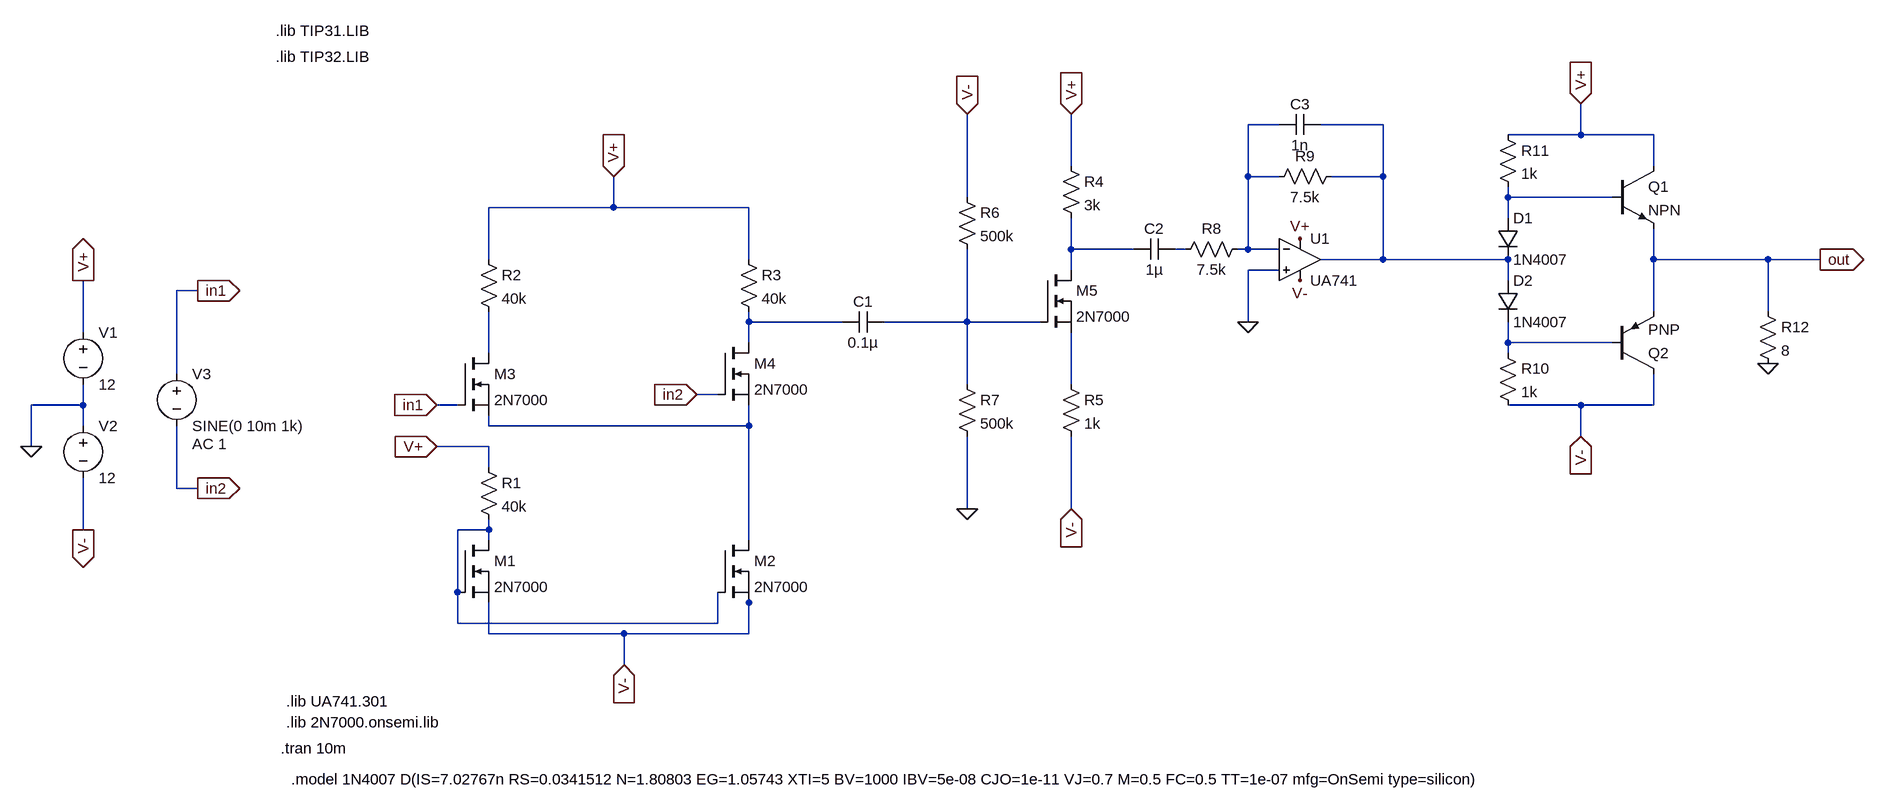
[diagram p0: schematic EW2_project1_final_1.asc]
EW2_project1_final_1.asc, the LTspice schematic file:
Version 4
SHEET 1 2576 680
WIRE 1280 -384 1232 -384
WIRE 1440 -384 1344 -384
WIRE 1744 -368 1744 -416
WIRE 1744 -368 1632 -368
WIRE 1856 -368 1744 -368
WIRE 960 -320 960 -400
WIRE 1856 -320 1856 -368
WIRE 1232 -304 1232 -384
WIRE 1280 -304 1232 -304
WIRE 1440 -304 1440 -384
WIRE 1440 -304 1360 -304
WIRE 800 -272 800 -400
WIRE 1632 -272 1632 -288
WIRE 1792 -272 1632 -272
WIRE 256 -256 256 -304
WIRE 256 -256 64 -256
WIRE 464 -256 256 -256
WIRE 1632 -240 1632 -272
WIRE 960 -192 960 -240
WIRE 1056 -192 960 -192
WIRE 1136 -192 1120 -192
WIRE 1232 -192 1232 -304
WIRE 1232 -192 1216 -192
WIRE 1280 -192 1232 -192
WIRE 64 -176 64 -256
WIRE 464 -176 464 -256
WIRE 1440 -176 1440 -304
WIRE 1440 -176 1344 -176
WIRE 1632 -176 1440 -176
WIRE 1856 -176 1856 -224
WIRE 2032 -176 1856 -176
WIRE 2112 -176 2032 -176
WIRE 960 -160 960 -192
WIRE 1280 -160 1232 -160
WIRE 1632 -144 1632 -176
WIRE -384 -128 -416 -128
WIRE 1856 -96 1856 -176
WIRE 2032 -96 2032 -176
WIRE 464 -80 464 -96
WIRE 608 -80 464 -80
WIRE 800 -80 800 -192
WIRE 800 -80 672 -80
WIRE 912 -80 800 -80
WIRE 1232 -80 1232 -160
WIRE -560 -64 -560 -144
WIRE 464 -48 464 -80
WIRE 1632 -48 1632 -80
WIRE 1792 -48 1632 -48
WIRE 64 -32 64 -96
WIRE 1632 -32 1632 -48
WIRE -416 0 -416 -128
WIRE 800 16 800 -80
WIRE 960 16 960 -64
WIRE 416 32 384 32
WIRE -560 48 -560 16
WIRE -560 48 -640 48
WIRE 16 48 -16 48
WIRE 1744 48 1632 48
WIRE 1856 48 1856 0
WIRE 1856 48 1744 48
WIRE -560 80 -560 48
WIRE 64 80 64 64
WIRE 464 80 464 48
WIRE 464 80 64 80
WIRE 1744 96 1744 48
WIRE -640 112 -640 48
WIRE 64 112 -16 112
WIRE 64 144 64 112
WIRE -416 176 -416 80
WIRE -384 176 -416 176
WIRE 800 208 800 96
WIRE 960 208 960 96
WIRE -560 240 -560 160
WIRE 64 240 64 224
WIRE 64 240 16 240
WIRE 64 256 64 240
WIRE 464 256 464 80
WIRE 16 336 16 240
WIRE 464 352 464 336
WIRE 16 384 16 336
WIRE 416 384 416 336
WIRE 416 384 16 384
WIRE 64 400 64 352
WIRE 272 400 64 400
WIRE 464 400 464 352
WIRE 464 400 272 400
WIRE 272 448 272 400
FLAG -640 112 0
FLAG -560 -144 V+
IOPIN -560 -144 Out
FLAG -560 240 V-
IOPIN -560 240 Out
FLAG -16 112 V+
IOPIN -16 112 In
FLAG 272 448 V-
IOPIN 272 448 In
FLAG 256 -304 V+
IOPIN 256 -304 In
FLAG -384 -128 in1
IOPIN -384 -128 Out
FLAG -16 48 in1
IOPIN -16 48 In
FLAG 384 32 in2
IOPIN 384 32 In
FLAG 960 -400 V+
IOPIN 960 -400 In
FLAG 960 208 V-
IOPIN 960 208 In
FLAG 800 208 0
FLAG 800 -400 V-
IOPIN 800 -400 In
FLAG 1232 -80 0
FLAG 1312 -208 V+
FLAG 1312 -144 V-
FLAG -384 176 in2
IOPIN -384 176 Out
FLAG 1744 -416 V+
IOPIN 1744 -416 In
FLAG 1744 96 V-
IOPIN 1744 96 In
FLAG 2032 -16 0
FLAG 2112 -176 out
IOPIN 2112 -176 Out
SYMBOL nmos 16 256 R0
SYMATTR InstName M1
SYMATTR Value 2N7000
SYMATTR Prefix X
SYMBOL nmos 416 256 R0
SYMATTR InstName M2
SYMATTR Value 2N7000
SYMATTR Prefix X
SYMBOL nmos 16 -32 R0
SYMATTR InstName M3
SYMATTR Value 2N7000
SYMATTR Prefix X
SYMBOL nmos 416 -48 R0
SYMATTR InstName M4
SYMATTR Value 2N7000
SYMATTR Prefix X
SYMBOL voltage -560 -80 R0
WINDOW 123 0 0 Left 0
WINDOW 39 0 0 Left 0
SYMATTR InstName V1
SYMATTR Value 12
SYMBOL voltage -560 64 R0
WINDOW 123 0 0 Left 0
WINDOW 39 0 0 Left 0
SYMATTR InstName V2
SYMATTR Value 12
SYMBOL res 48 128 R0
SYMATTR InstName R1
SYMATTR Value 40k
SYMBOL res 48 -192 R0
SYMATTR InstName R2
SYMATTR Value 40k
SYMBOL res 448 -192 R0
SYMATTR InstName R3
SYMATTR Value 40k
SYMBOL cap 672 -96 R90
WINDOW 0 0 32 VBottom 2
WINDOW 3 32 32 VTop 2
SYMATTR InstName C1
SYMATTR Value 0.1µ
SYMBOL nmos 912 -160 R0
SYMATTR InstName M5
SYMATTR Value 2N7000
SYMATTR Prefix X
SYMBOL res 944 -336 R0
SYMATTR InstName R4
SYMATTR Value 3k
SYMBOL res 944 0 R0
SYMATTR InstName R5
SYMATTR Value 1k
SYMBOL res 784 -288 R0
SYMATTR InstName R6
SYMATTR Value 500k
SYMBOL res 784 0 R0
SYMATTR InstName R7
SYMATTR Value 500k
SYMBOL cap 1120 -208 R90
WINDOW 0 0 32 VBottom 2
WINDOW 3 32 32 VTop 2
SYMATTR InstName C2
SYMATTR Value 1µ
SYMBOL OpAmps\\opamp2 1312 -240 R0
SYMATTR InstName U1
SYMATTR Value UA741
SYMBOL res 1232 -208 R90
WINDOW 0 0 56 VBottom 2
WINDOW 3 32 56 VTop 2
SYMATTR InstName R8
SYMATTR Value 7.5k
SYMBOL res 1376 -320 R90
WINDOW 0 0 56 VBottom 2
WINDOW 3 32 56 VTop 2
SYMATTR InstName R9
SYMATTR Value 7.5k
SYMBOL cap 1344 -400 R90
WINDOW 0 0 32 VBottom 2
WINDOW 3 32 32 VTop 2
SYMATTR InstName C3
SYMATTR Value 1n
SYMBOL voltage -416 -16 R0
WINDOW 123 24 124 Left 2
WINDOW 39 0 0 Left 0
SYMATTR Value2 AC 1
SYMATTR InstName V3
SYMATTR Value SINE(0 10m 1k)
SYMBOL diode 1616 -240 R0
SYMATTR InstName D1
SYMATTR Value 1N4007
SYMBOL diode 1616 -144 R0
SYMATTR InstName D2
SYMATTR Value 1N4007
SYMBOL res 1616 -48 R0
SYMATTR InstName R10
SYMATTR Value 1k
SYMBOL res 1616 -384 R0
SYMATTR InstName R11
SYMATTR Value 1k
SYMBOL npn 1792 -320 R0
SYMATTR InstName Q1
SYMATTR Prefix Qtip31
SYMBOL pnp 1792 0 M180
SYMATTR InstName Q2
SYMATTR Prefix Qtip32
SYMBOL res 2016 -112 R0
SYMATTR InstName R12
SYMATTR Value 8
TEXT -248 536 Left 2 !.lib 2N7000.onsemi.lib
TEXT -248 504 Left 2 !.lib UA741.301
TEXT -256 576 Left 2 !.tran 10m
TEXT -240 624 Left 2 !.model 1N4007 D(IS=7.02767n RS=0.0341512 N=1.80803 EG=1.05743 XTI=5 BV=1000 IBV=5e-08 CJO=1e-11 VJ=0.7 M=0.5 FC=0.5 TT=1e-07 mfg=OnSemi type=silicon)
TEXT -264 -528 Left 2 !.lib TIP31.LIB
TEXT -264 -488 Left 2 !.lib TIP32.LIB

The netlist it stands for:
* EW2_project1_final_1.asc
XM1 N012 N012 V- 2N7000  ; pins D G S
XM2 N011 N012 V- 2N7000  ; pins D G S
XM3 N009 in1 N011 2N7000  ; pins D G S
XM4 N006 in2 N011 2N7000  ; pins D G S
V1 V+ 0 12
V2 0 V- 12
R1 V+ N012 40k
R2 V+ N009 40k
R3 V+ N006 40k
C1 N007 N006 0.1µ
XM5 N004 N007 N010 2N7000  ; pins D G S
R4 V+ N004 3k
R5 N010 V- 1k
R6 V- N007 500k
R7 N007 0 500k
C2 N005 N004 1µ
XU1 0 N001 V+ V- N002 UA741  ; pins In+ In- V+ V- OUT
R8 N001 N005 7.5k
R9 N002 N001 7.5k
C3 N002 N001 1n
V3 in1 in2 SINE(0 10m 1k) AC 1
D1 N003 N002 1N4007
D2 N002 N008 1N4007
R10 N008 V- 1k
R11 V+ N003 1k
Q1 V+ N003 out 0 NPN
Q2 V- N008 out 0 PNP
R12 out 0 8
.model D D
.lib standard.dio
.model NPN NPN
.model PNP PNP
.lib standard.bjt
.lib 2N7000.onsemi.lib
.lib UA741.301
.tran 10m
.model 1N4007 D(IS=7.02767n RS=0.0341512 N=1.80803 EG=1.05743 XTI=5 BV=1000 IBV=5e-08 CJO=1e-11 VJ=0.7 M=0.5 FC=0.5 TT=1e-07 mfg=OnSemi type=silicon)
.lib TIP31.LIB
.lib TIP32.LIB
.backanno
.end